# EAGLE design UnknownWatch_Top (EAGLE 9.6.2)
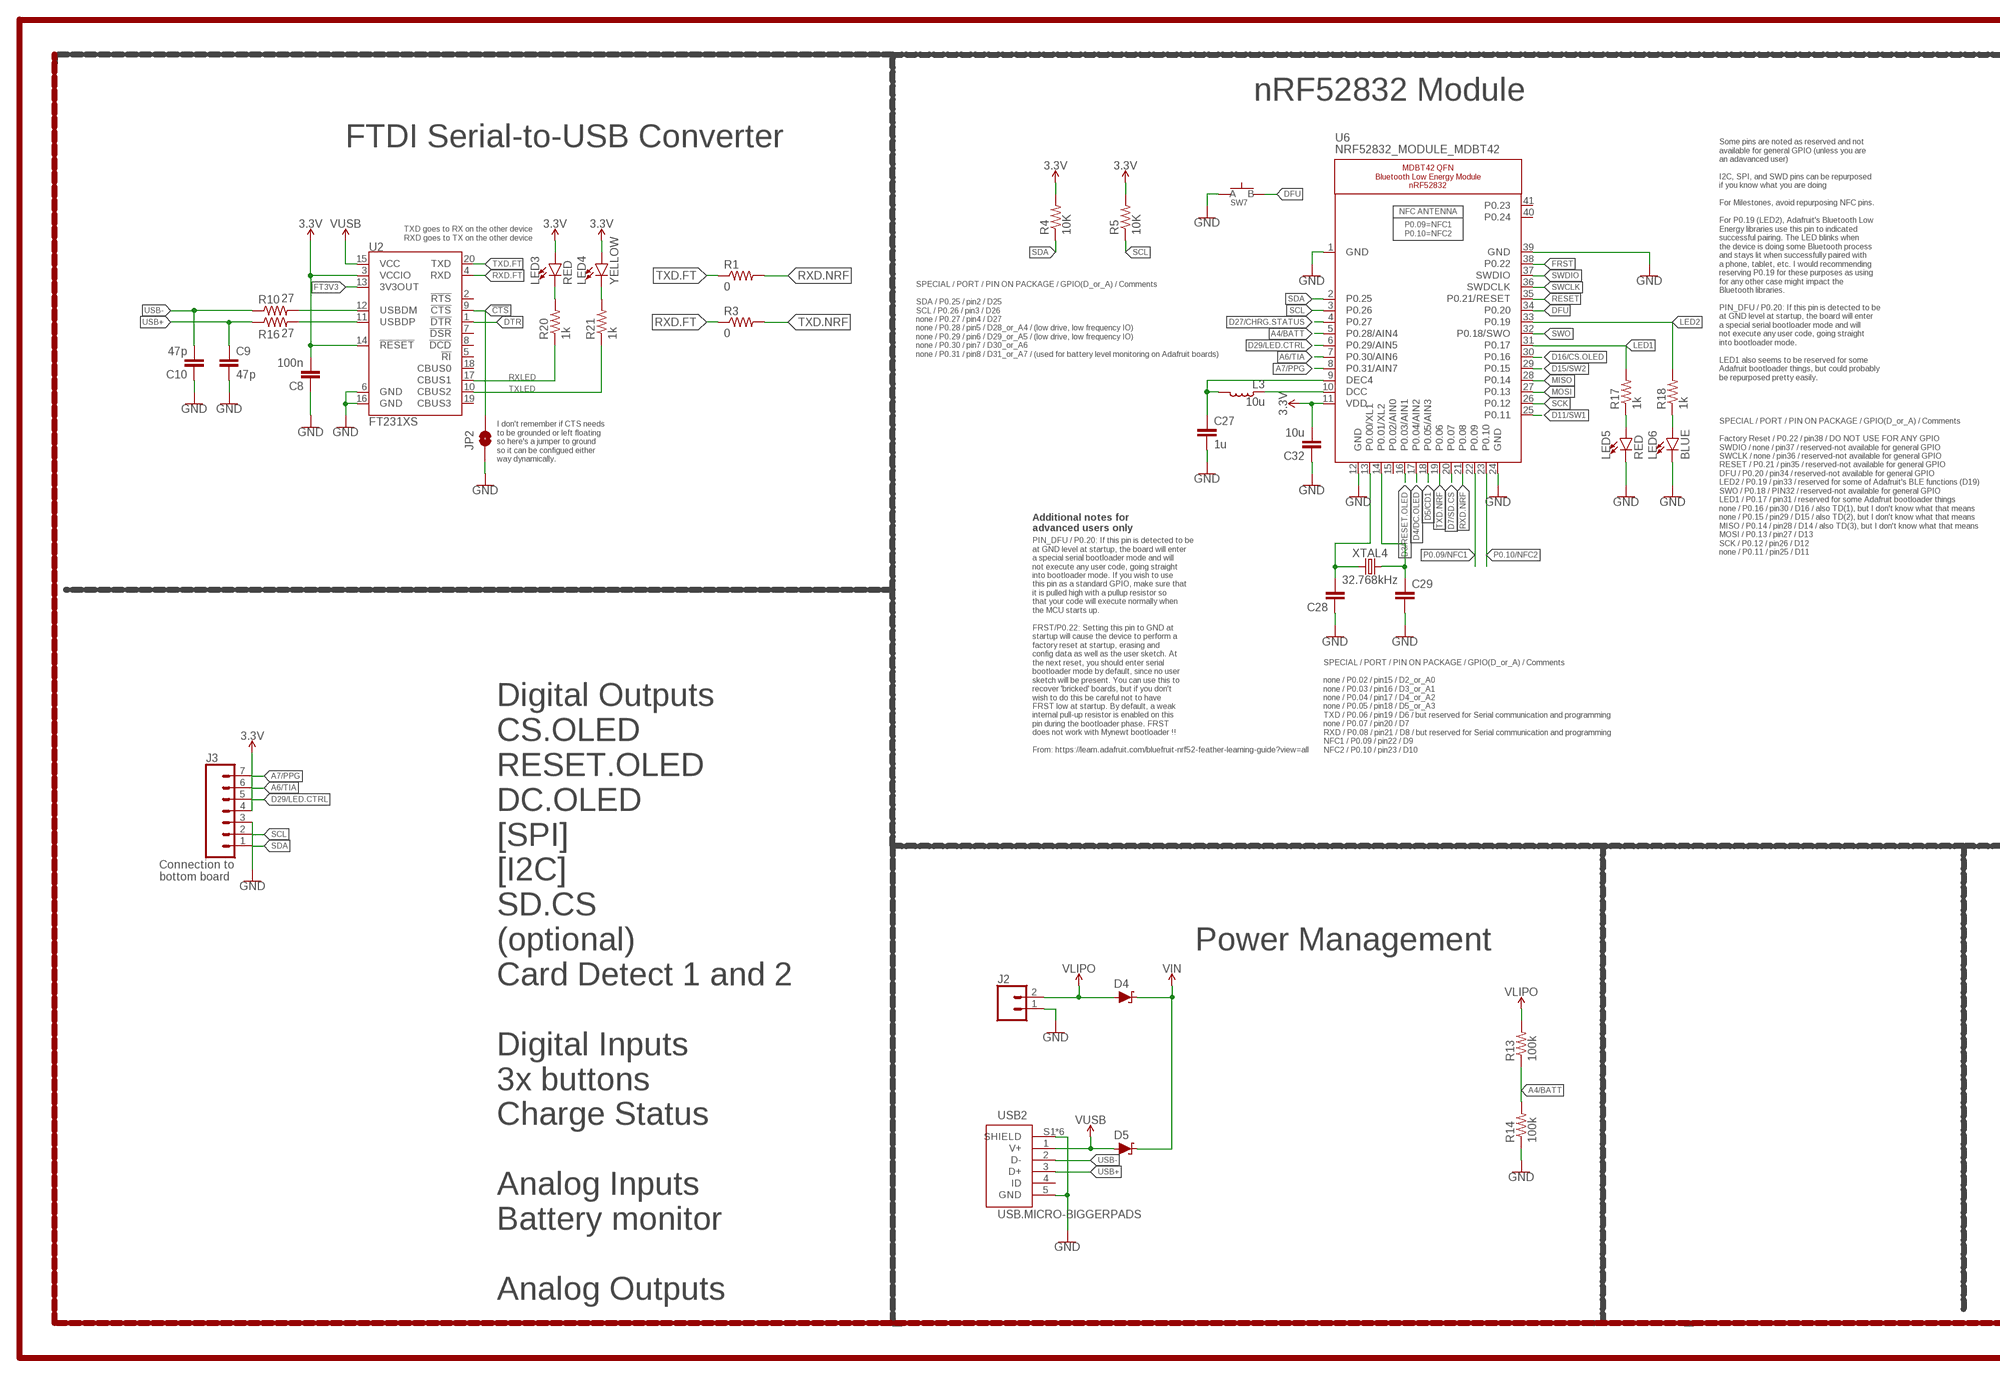
[diagram p0: schematic, sheet 1, part 1 of 2]
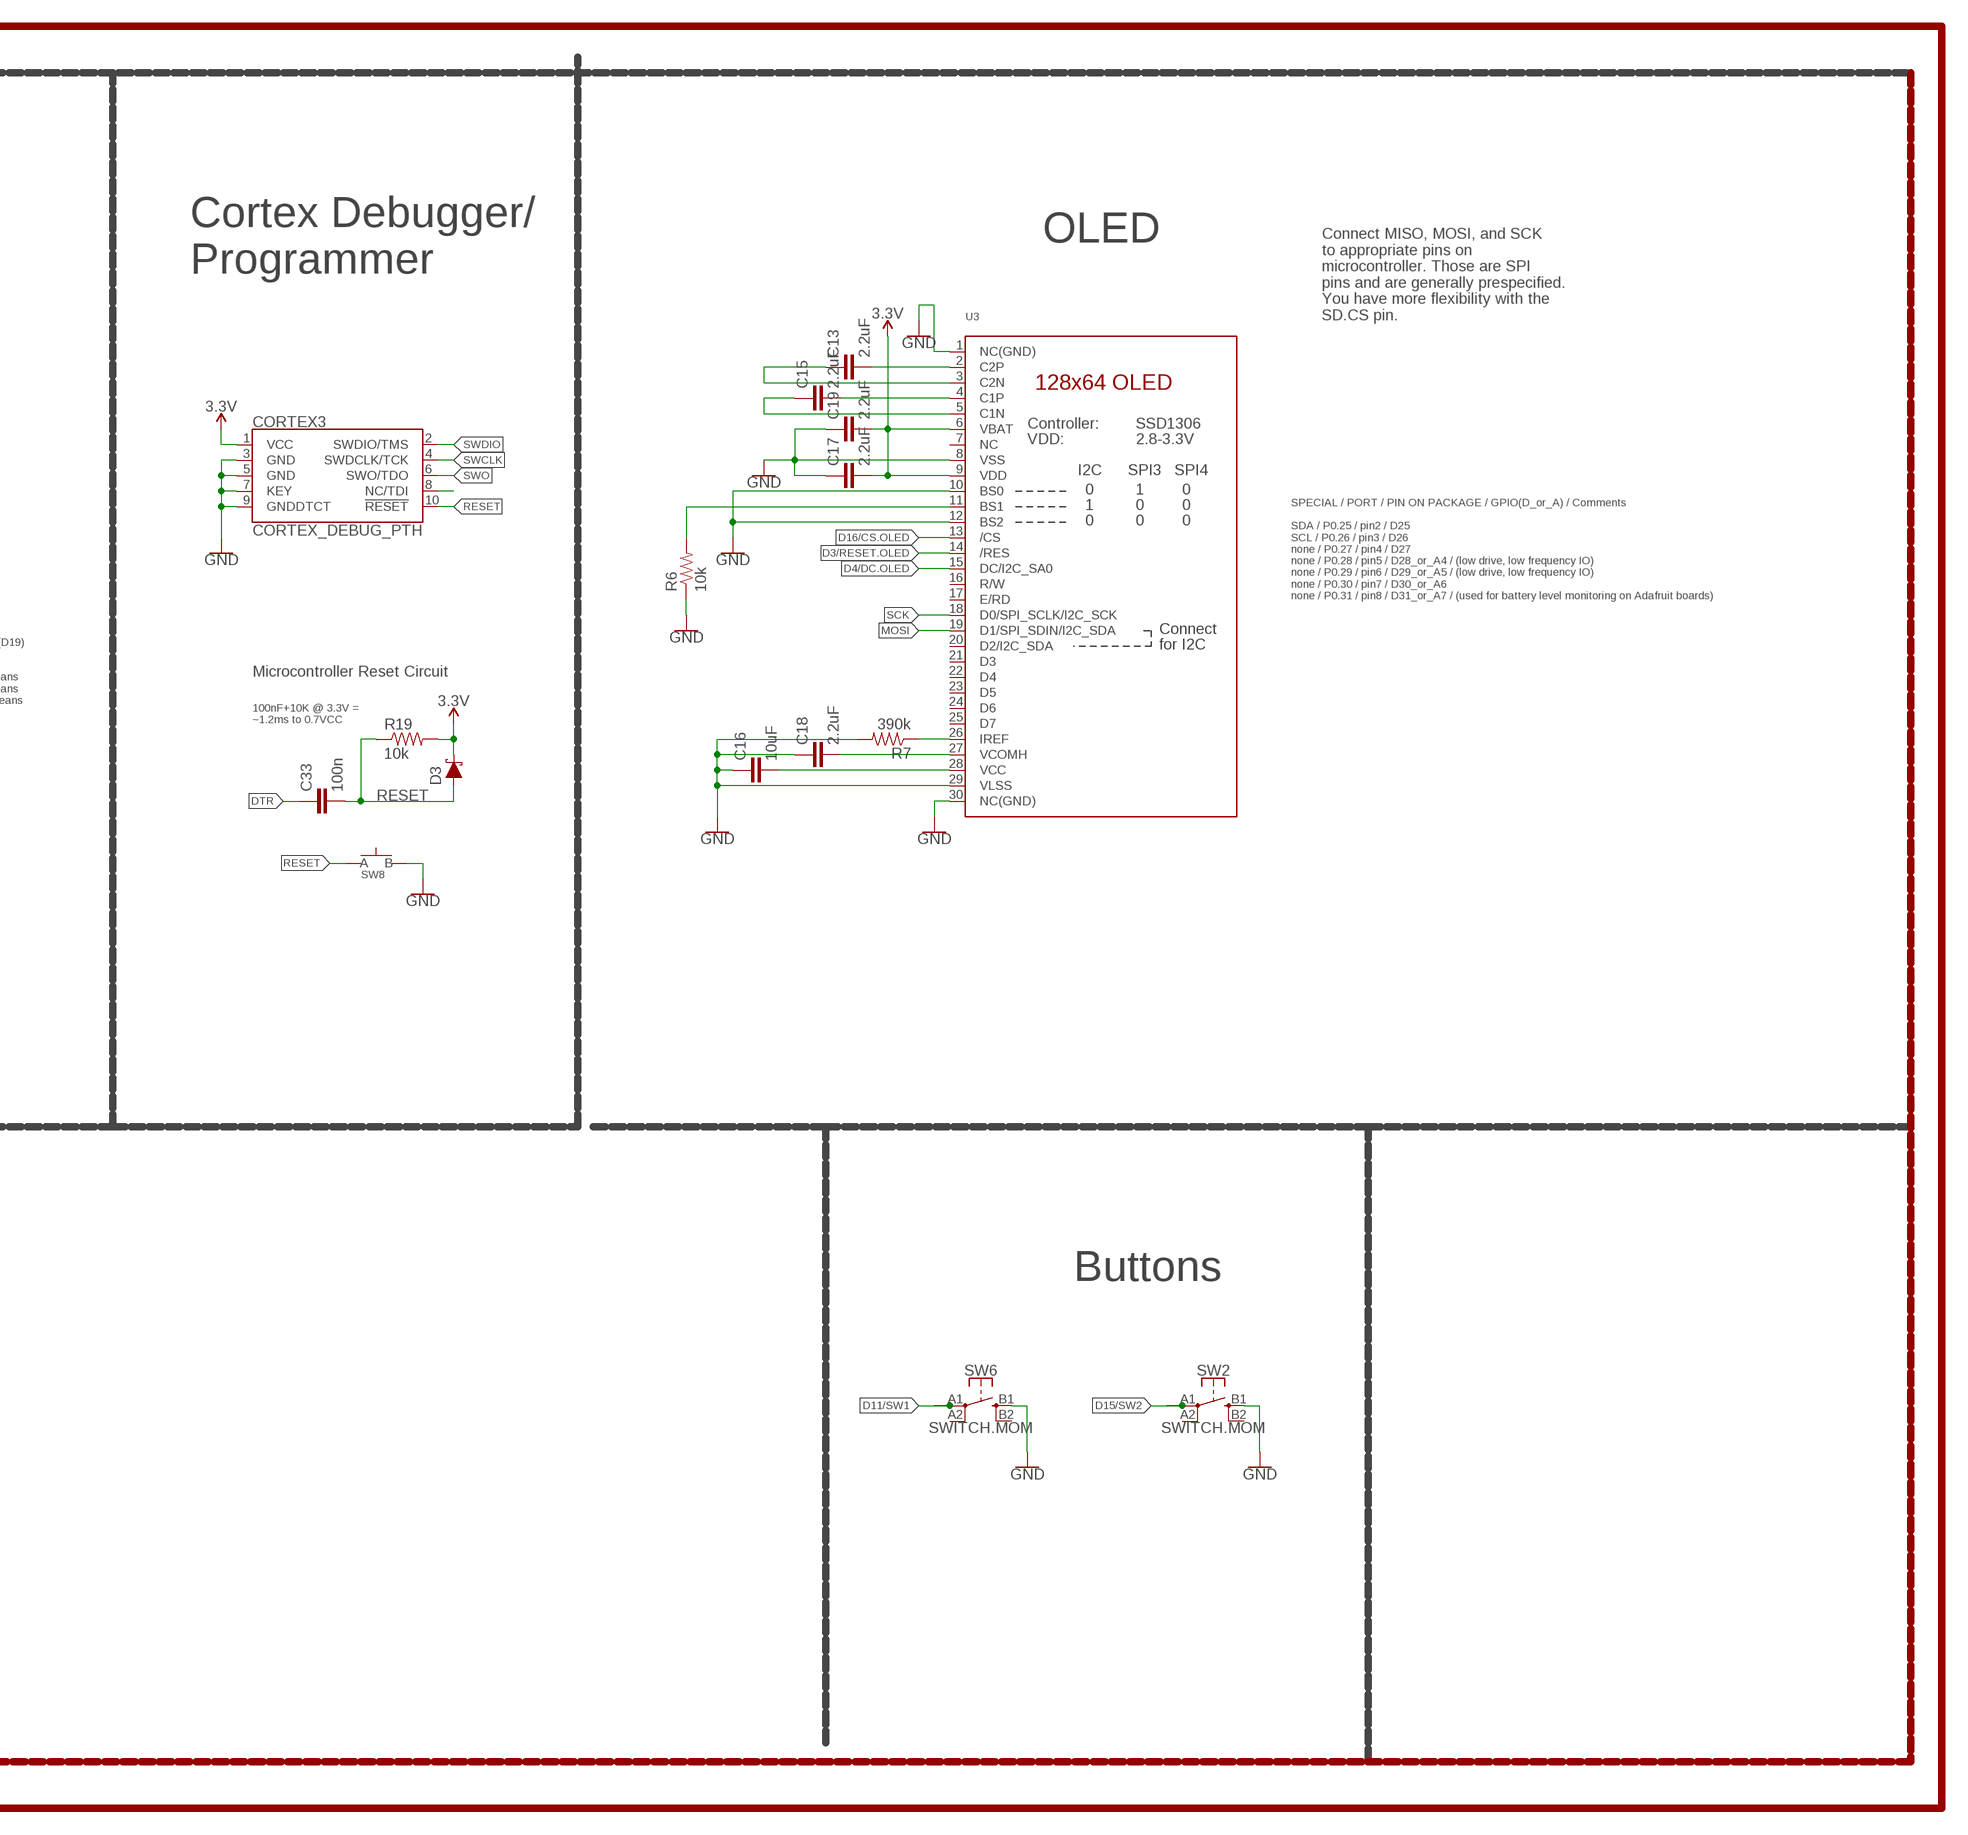
[diagram p1: schematic, sheet 1, part 2 of 2]

## Parts
C8  100n  CAPACITOR0603  [C0603]
C9  47p  CAPACITOR0603  [C0603]
C10  47p  CAPACITOR0603  [C0603]
C13  2.2uF  CAPACITOR0402  [C0402]
C15  2.2uF  CAPACITOR0402  [C0402]
C16  10uF  CAPACITOR0603  [C0603]
C17  2.2uF  CAPACITOR0402  [C0402]
C18  2.2uF  CAPACITOR0402  [C0402]
C19  2.2uF  CAPACITOR0402  [C0402]
C27  1u  CAPACITOR0603  [C0603]
C28  CAPACITOR0603  [C0603]
C29  CAPACITOR0603  [C0603]
C32  10u  CAPACITOR0805  [C0805]
C33  100n  CAPACITOR0603  [C0603]
CORTEX3  CORTEX_DEBUG_PTH  [2X5-PTH-1.27MM]
D3  SCHOTTKY-USC  [USC]
D4  SCHOTTKY-USC  [USC]
D5  SCHOTTKY-USC  [USC]
J2  CONN_02  [1X02]
J3  CONN_07-1.27MM  [1X07_1.27MM]
JP2  JUMPER-SMT_2_NO_SILK  [SMT-JUMPER_2_NO_SILK]
L3  10u  INDUCTOR0603  [L0603]
LED3  RED  LED0603  [LED-0603]
LED4  YELLOW  LED0603  [LED-0603]
LED5  RED  LED0603  [LED-0603]
LED6  BLUE  LED0603  [LED-0603]
R1  0  RESISTOR0603  [R0603]
R3  0  RESISTOR0603  [R0603]
R4  10K  RESISTOR0603  [R0603]
R5  10K  RESISTOR0603  [R0603]
R6  10k  RESISTOR0603  [R0603]
R7  390k  RESISTOR0603  [R0603]
R10  27  RESISTOR0603  [R0603]
R13  100k  RESISTOR0603  [R0603]
R14  100k  RESISTOR0603  [R0603]
R16  27  RESISTOR0603  [R0603]
R17  1k  RESISTOR0603  [R0603]
R18  1k  RESISTOR0603  [R0603]
R19  10k  RESISTOR0603  [R0603]
R20  1k  RESISTOR0603  [R0603]
R21  1k  RESISTOR0603  [R0603]
SW2  SWITCH.MOM  [TACTILE_SWITCH_SMD_6.2MM_TALL]
SW6  SWITCH.MOM  [TACTILE_SWITCH_SMD_6.2MM_TALL]
SW7  SPST-PTS830GG140-COPY.1-3  [BUTTON-GULLWING]
SW8  SPST-PTS830GG140-COPY.1-3  [BUTTON-GULLWING]
U2  FT231XS  [SSOP20_L]
U3  DISP_OLED_UG-2864HSWEG01-NO-WRAPAROUND  [UG-2864HSWEG01_0.96IN_NO-WRAPAROUND]
U6  NRF52832_MODULE_MDBT42  [BLE_MODULE_RAYTAC_MDBT42]
USB2  USB.MICRO-BIGGERPADS  [USB-MICRO-01.BIGGERPADS]
XTAL4  32.768kHz  CRYSTALECS-.327-12.5-12-C-TR  [2-SMD.NOLEAD.2.0MMTO1.2MM]

## Nets
3.3V: C8.2 C17.2 C19.2 C32.2 CORTEX3.1(VCC) D3.-(C) J3.4 LED3.A LED4.A R4.2 R5.2 R19.2 U2.3(VCCIO) U2.14(!RESET) U3.6(VBAT) U3.9(VDD) U6.11(VDD)
!CTS: JP2.2 U2.9(!CTS)
A4/BATT: R13.1 R14.2 U6.5(P0.28/AIN4)
A6/TIA: J3.6 U6.7(P0.30/AIN6)
A7/PPG: J3.7 U6.8(P0.31/AIN7)
D3/RESET.OLED: U3.14(/RES) U6.16(P0.03/AIN1)
D4/DC.OLED: U3.15(DC/I2C_SA0) U6.17(P0.04/AIN2)
D5/CD1: U6.18(P0.05/AIN3)
D7/SD.CS: U6.20(P0.07)
D11/SW1: SW6.A1 U6.25(P0.11)
D15/SW2: SW2.A1 U6.29(P0.15)
D16/CS.OLED: U3.13(/CS) U6.30(P0.16)
D27/CHRG.STATUS: U6.4(P0.27)
D29/LED.CTRL: J3.5 U6.6(P0.29/AIN5)
DFU: SW7.3(B) U6.34(P0.20)
DTR: C33.1 U2.1(!DTR)
FRST: U6.38(P0.22)
FT3V3: U2.13(3V3OUT)
GND: C8.1 C9.2 C10.1 C16.1 C17.1 C18.1 C19.1 C27.2 C28.1 C29.2 C32.1 CORTEX3.3(GND) CORTEX3.5(GND) CORTEX3.7(KEY) CORTEX3.9(GNDDTCT) J2.1 J3.3 JP2.1 LED5.C LED6.C R6.1 R7.2 R14.1 SW2.B1 SW6.B1 SW7.1(A) SW8.3(B) U2.6(GND) U2.16(GND) U3.1(NC(GND)) U3.8(VSS) U3.10(BS0) U3.12(BS2) U3.29(VLSS) U3.30(NC(GND)) U6.1(GND) U6.12(GND) U6.24(GND) U6.39(GND) USB2.5(GND) USB2.S1(SHIELD) USB2.S2(SHIELD) USB2.S3(SHIELD) USB2.S4(SHIELD) USB2.S5(SHIELD) USB2.S6(SHIELD)
LED1: R17.2 U6.31(P0.17)
LED2: R18.2 U6.33(P0.19)
MISO: U6.28(P0.14)
MOSI: U3.19(D1/SPI_SDIN/I2C_SDA) U6.27(P0.13)
N$1: R6.2 U3.11(BS1)
N$2: R7.1 U3.26(IREF)
N$3: C13.2 U3.2(C2P)
N$5: C13.1 U3.3(C2N)
N$7: C15.2 U3.4(C1P)
N$8: C15.1 U3.5(C1N)
N$11: R10.2 U2.12(USBDM)
N$12: R16.2 U2.11(USBDP)
N$13: C16.2 U3.28(VCC)
N$14: LED3.C R20.2
N$15: C18.2 U3.27(VCOMH)
N$16: LED4.C R21.2
N$26: C28.2 U6.13(P0.00/XL1) XTAL4.P$1
N$27: C29.1 U6.14(P0.01/XL2) XTAL4.P$2
N$28: LED5.A R17.1
N$29: LED6.A R18.1
N$30: L3.1 U6.10(DCC)
N$31: C27.1 L3.2 U6.9(DEC4)
N$32: CORTEX3.8(NC/TDI)
P0.09/NFC1: U6.22(P0.09)
P0.10/NFC2: U6.23(P0.10)
RESET: C33.2 CORTEX3.10(!RESET) D3.+(A) R19.1 SW8.1(A) U6.35(P0.21/RESET)
RXD.FT: R3.1 U2.4(RXD)
RXD.NRF: R1.2 U6.21(P0.08)
RXLED: R20.1 U2.17(CBUS1)
SCK: U3.18(D0/SPI_SCLK/I2C_SCK) U6.26(P0.12)
SCL: J3.2 R5.1 U6.3(P0.26)
SDA: J3.1 R4.1 U6.2(P0.25)
SWCLK: CORTEX3.4(SWDCLK/TCK) U6.36(SWDCLK)
SWDIO: CORTEX3.2(SWDIO/TMS) U6.37(SWDIO)
SWO: CORTEX3.6(SWO/TDO) U6.32(P0.18/SWO)
TXD.FT: R1.1 U2.20(TXD)
TXD.NRF: R3.2 U6.19(P0.06)
TXLED: R21.1 U2.10(CBUS2)
USB+: C9.1 R16.1 USB2.3(D+)
USB-: C10.2 R10.1 USB2.2(D-)
V_USB: D5.+(A) U2.15(VCC) USB2.1(V+) ; supply symbol labelled VUSB
VIN: D4.-(C) D5.-(C)
VLIPO: D4.+(A) J2.2 R13.2
Unconnected: SW2.A2 SW2.B2 SW6.A2 SW6.B2 U2.2(!RTS) U2.5(!RI) U2.7(!DSR) U2.8(!DCD) U2.18(CBUS0) U2.19(CBUS3) U3.7(NC) U3.16(R/W) U3.17(E/RD) U3.20(D2/I2C_SDA) U3.21(D3) U3.22(D4) U3.23(D5) U3.24(D6) U3.25(D7) U6.15(P0.02/AIN0) U6.40(P0.24) U6.41(P0.23) USB2.4(ID)

## Notes on the sheet
- nRF52832 Module
- FTDI Serial-to-USB Converter
- OLED
- Cortex Debugger/
  Programmer
- TXD goes to RX on the other device
  RXD goes to TX on the other device
- Connect MISO, MOSI, and SCK
  to appropriate pins on
  microcontroller. Those are SPI
  pins and are generally prespecified.
  You have more flexibility with the
  SD.CS pin.
- SPECIAL / PORT / PIN ON PACKAGE / GPIO(D_or_A) / Comments
  
  SDA / P0.25 / pin2 / D25
  SCL / P0.26 / pin3 / D26
  none / P0.27 / pin4 / D27
  none / P0.28 / pin5 / D28_or_A4 / (low drive, low frequency IO)
  none / P0.29 / pin6 / D29_or_A5 / (low drive, low frequency IO)
  none / P0.30 / pin7 / D30_or_A6
  none / P0.31 / pin8 / D31_or_A7 / (used for battery level monitoring on Adafruit boards)
- Some pins are noted as reserved and not
  available for general GPIO (unless you are
  an adavanced user)
  
  I2C, SPI, and SWD pins can be repurposed
  if you know what you are doing
  
  For Milestones, avoid repurposing NFC pins.
  
  For P0.19 (LED2), Adafruit's Bluetooth Low
  Energy libraries use this pin to indicated
  successful pairing. The LED blinks when
  the device is doing some Bluetooth process
  and stays lit when successfully paired with
  a phone, tablet, etc. I would recommending
  reserving P0.19 for these purposes as using
  for any other case might impact the
  Bluetooth libraries.
  
  PIN_DFU / P0.20: If this pin is detected to be
  at GND level at startup, the board will enter
  a special serial bootloader mode and will
  not execute any user code, going straight
  into bootloader mode.
  
  LED1 also seems to be reserved for some
  Adafruit bootloader things, but could probably
  be repurposed pretty easily.
- SPECIAL / PORT / PIN ON PACKAGE / GPIO(D_or_A) / Comments
  
  SDA / P0.25 / pin2 / D25
  SCL / P0.26 / pin3 / D26
  none / P0.27 / pin4 / D27
  none / P0.28 / pin5 / D28_or_A4 / (low drive, low frequency IO)
  none / P0.29 / pin6 / D29_or_A5 / (low drive, low frequency IO)
  none / P0.30 / pin7 / D30_or_A6
  none / P0.31 / pin8 / D31_or_A7 / (used for battery level monitoring on Adafruit boards)
- I don't remember if CTS needs
  to be grounded or left floating
  so here's a jumper to ground
  so it can be configued either
  way dynamically.
- Microcontroller Reset Circuit
- Additional notes for
  advanced users only
- 100nF+10K @ 3.3V =
  ~1.2ms to 0.7VCC
- SPECIAL / PORT / PIN ON PACKAGE / GPIO(D_or_A) / Comments
  
  Factory Reset / P0.22 / pin38 / DO NOT USE FOR ANY GPIO
  SWDIO / none / pin37 / reserved-not available for general GPIO
  SWCLK / none / pin36 / reserved-not available for general GPIO
  RESET / P0.21 / pin35 / reserved-not available for general GPIO
  DFU / P0.20 / pin34 / reserved-not available for general GPIO
  LED2 / P0.19 / pin33 / reserved for some of Adafruit's BLE functions (D19)
  SWO / P0.18 / PIN32 / reserved-not available for general GPIO
  LED1 / P0.17 / pin31 / reserved for some Adafruit bootloader things
  none / P0.16 / pin30 / D16 / also TD(1), but I don't know what that means
  none / P0.15 / pin29 / D15 / also TD(2), but I don't know what that means
  MISO / P0.14 / pin28 / D14 / also TD(3), but I don't know what that means
  MOSI / P0.13 / pin27 / D13
  SCK / P0.12 / pin26 / D12
  none / P0.11 / pin25 / D11
- PIN_DFU / P0.20: If this pin is detected to be
  at GND level at startup, the board will enter
  a special serial bootloader mode and will
  not execute any user code, going straight
  into bootloader mode. If you wish to use
  this pin as a standard GPIO, make sure that
  it is pulled high with a pullup resistor so
  that your code will execute normally when
  the MCU starts up.
  
  FRST/P0.22: Setting this pin to GND at
  startup will cause the device to perform a
  factory reset at startup, erasing and
  config data as well as the user sketch. At
  the next reset, you should enter serial
  bootloader mode by default, since no user
  sketch will be present. You can use this to
  recover 'bricked' boards, but if you don't
  wish to do this be careful not to have
  FRST low at startup. By default, a weak
  internal pull-up resistor is enabled on this
  pin during the bootloader phase. FRST
  does not work with Mynewt bootloader !!
  
  From: https://learn.adafruit.com/bluefruit-nrf52-feather-learning-guide?view=all
- SPECIAL / PORT / PIN ON PACKAGE / GPIO(D_or_A) / Comments
  
  none / P0.02 / pin15 / D2_or_A0
  none / P0.03 / pin16 / D3_or_A1
  none / P0.04 / pin17 / D4_or_A2
  none / P0.05 / pin18 / D5_or_A3
  TXD / P0.06 / pin19 / D6 / but reserved for Serial communication and programming
  none / P0.07 / pin20 / D7
  RXD / P0.08 / pin21 / D8 / but reserved for Serial communication and programming
  NFC1 / P0.09 / pin22 / D9
  NFC2 / P0.10 / pin23 / D10
- Connection to 
  bottom board
- Power Management
- Buttons
- Digital Outputs
  CS.OLED
  RESET.OLED
  DC.OLED
  [SPI]
  [I2C]
  SD.CS
  (optional) 
  Card Detect 1 and 2
  
  Digital Inputs 
  3x buttons
  Charge Status
  
  Analog Inputs 
  Battery monitor
  
  Analog Outputs

## Library data of the parts
C8-C10 C13 C15-C19 C27-C29 C32 C33 = LinnesLab-Passives:CAPACITOR
CORTEX3 = LinnesLab-Connectors:CORTEX_DEBUG: Cortex Debug Connector - 10 pin Supports JTAG debug, Serial Wire debug, and Serial Wire Viewer. PTH and SMD connector options available. General Connector Information <http://infocenter.arm.com/help/topic/com.arm.doc.faqs/attached/13634/cortex_debug_connectors.pdf> Products: PTH Connector <http://www.digikey.com/product-detail/en/cnc-tech/3220-10-0100-00/1175-1627-ND/3883661> -via Digi-Key SparkFun PSoc <https://www.sparkfun.com/products/13229> SparkFun T <https://www.sparkfun.com/products/13810>
D3-D5 = LinnesLab-DiscreteSemi:SCHOTTKY: Schottky diode A Schottky diode is a semiconductor diode which has a low forward voltage drop and a very fast switching action. Example: Digi-Key Part Number: RB161MM-20CT-ND
J2 = LinnesLab-Connectors:CONN_02: Multi connection point. Often used as Generic Header-pin footprint for 0.1 inch spaced/style header connections On any of the 0.1 inch spaced packages, you can populate with these: Break Away Headers - Straight <https://www.sparkfun.com/products/116> (PRT-00116) Break Away Male Headers - Right Angle <https://www.sparkfun.com/products/553> (PRT-00553) Female Headers <https://www.sparkfun.com/products/115> (PRT-00115) Break Away Headers - Machine Pin <https://www.sparkfun.com/products/117> (PRT-00117) Break Away Female Headers - Swiss Machine Pin <https://www.sparkfun.com/products/743> (PRT-00743) For SCREWTERMINALS and SPRING TERMINALS visit here: Screw Terimnals on SparkFun.com <https://www.sparkfun.com/search/results?term=Screw+Terminals> (5mm/3.5mm/2.54mm spacing) This device is also useful as a general connection point to wire up your design to another part of your project. Our various solder wires solder well into these plated through hole pads. Hook-Up Wire - Assortment (Stranded, 22 AWG) <https://www.sparkfun.com/products/11375> (PRT-11375) Hook-Up Wire - Assortment (Solid Core, 22 AWG) <https://www.sparkfun.com/products/11367> (PRT-11367) View the entire wire category on our website here <https://www.sparkfun.com/categories/141> Special notes: Molex polarized connector foot print use with: PRT-08233 with associated crimp pins and housings. 2.54_SCREWTERM for use with PRT-10571. 3.5mm Screw Terminal footprints for PRT-08084 5mm Screw Terminal footprints for use with PRT-08432
J3 = LinnesLab-Connectors:CONN_07: Multi connection point. Often used as Generic Header-pin footprint for 0.1 inch spaced/style header connections On any of the 0.1 inch spaced packages, you can populate with these: Break Away Headers - Straight <https://www.sparkfun.com/products/116> (PRT-00116) Break Away Male Headers - Right Angle <https://www.sparkfun.com/products/553> (PRT-00553) Female Headers <https://www.sparkfun.com/products/115> (PRT-00115) Break Away Headers - Machine Pin <https://www.sparkfun.com/products/117> (PRT-00117) Break Away Female Headers - Swiss Machine Pin <https://www.sparkfun.com/products/743> (PRT-00743) For SCREWTERMINALS and SPRING TERMINALS visit here: Screw Terimnals on SparkFun.com <https://www.sparkfun.com/search/results?term=Screw+Terminals> (5mm/3.5mm/2.54mm spacing) This device is also useful as a general connection point to wire up your design to another part of your project. Our various solder wires solder well into these plated through hole pads. Hook-Up Wire - Assortment (Stranded, 22 AWG) <https://www.sparkfun.com/products/11375> (PRT-11375) Hook-Up Wire - Assortment (Solid Core, 22 AWG) <https://www.sparkfun.com/products/11367> (PRT-11367) View the entire wire category on our website here <https://www.sparkfun.com/categories/141> Special notes: Molex polarized connector foot print use with SKU : PRT-08231 with associated crimp pins and housings. 1MM SMD Version SKU: PRT-10208 NOTES ON THE VARIANTS LOCK and LOCK_LONGPADS... This footprint was designed to help hold the alignment of a through-hole component (i.e. 6-pin header) while soldering it into place. You may notice that each hole has been shifted either up or down by 0.005 of an inch from it's more standard position (which is a perfectly straight line). This slight alteration caused the pins (the squares in the middle) to touch the edges of the holes. Because they are alternating, it causes a "brace" to hold the component in place. 0.005 has proven to be the perfect amount of "off-center" position when using our standard breakaway headers. Although looks a little odd when you look at the bare footprint, once you have a header in there, the alteration is very hard to notice. Also,if you push a header all the way into place, it is covered up entirely on the bottom side.
JP2 = LinnesLab-Switches:JUMPER-SMT_2_NO: Normally open jumper This jumper has two pads in close proximity to each other. Apply solder to close the connection. Round pads are easier to solder for beginners, but are a lot larger. SparkFun Product that uses the round pads: SparkFun EL Sequencer <https://www.sparkfun.com/products/12781>
L3 = LinnesLab-Passives:INDUCTOR
LED3-LED6 = LinnesLab-LED:LED: LED (Generic) Standard schematic elements and footprints for 5mm, 3mm, 1206, and 0603 sized LEDs. Generic LEDs with no color specified. LTST-C190KGKT: arrow indicates cathode
R1 R3-R7 R10 R13 R14 R16-R21 = LinnesLab-Passives:RESISTOR
SW2 SW6 = LinnesLab-Switches:SWITCH.MOM: PTS645SM43SMTR92 LFS
SW7 SW8 = LinnesLab-Switches:SPST-PTS830GG140-COPY
U2 = LinnesLab-DigitalIC:FT231X: FTDI FT231X Full Speed USB to Full-handshake UART This USB2.0 Full Speed IC offers a compact bridge to full handshake UART interfaces. The device is a UART, capable of operating up to 3MBaud, with low power consumption (8mA). The FT231X includes the complete FT-X series feature set and enables USB to be added into a system design quickly and easily over a UART interface. Datasheet <http://cdn.sparkfun.com/datasheets/Components/General%20IC/DS_FT231X.pdf>; DIGIKEY: 768-1156-5-ND; MFN: FT231XS-U
U3 = LinnesLab-Displays:DISP_OLED_UG-2864HSWEG01: UG-2864HSWEG01 OLED display Both 1.3" and 0.96" models share the same FPC tab footprint, only the screen dimensions vary.
U6 = LinnesLab-Microcontrollers:NRF52832_MODULE_MDBT42: MDBT42 - BLE Module (nRF52832 QFN) VDD: 1.7-3.6V
USB2 = LinnesLab-Connectors:USB.MICRO: DigiKey PN: 609-4613-1-ND
XTAL4 = LinnesLab-Clocks:CRYSTAL; DIGIKEY: XC2288CT-ND; FREQ: 32.7680KHZ; LOAD_CAP: 12.5pF

## Board
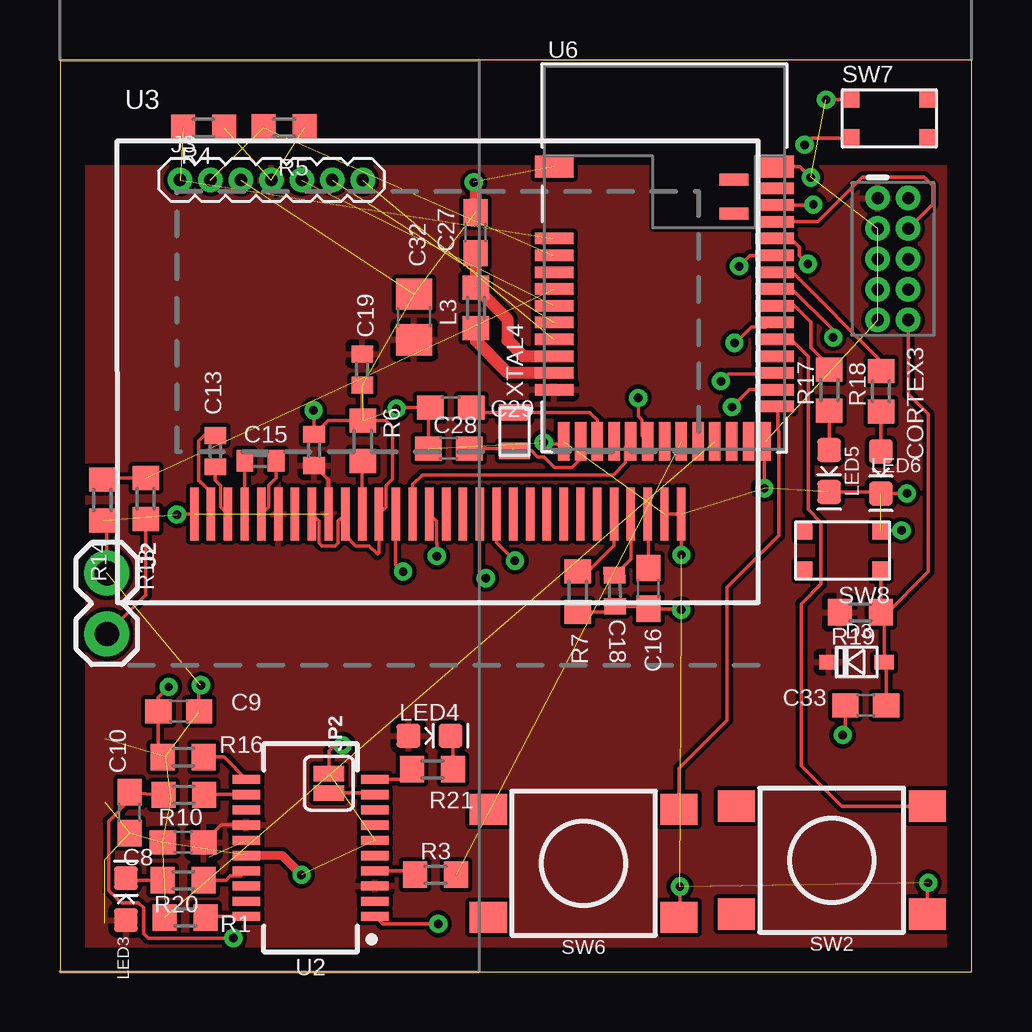
[diagram p2: board, top side]
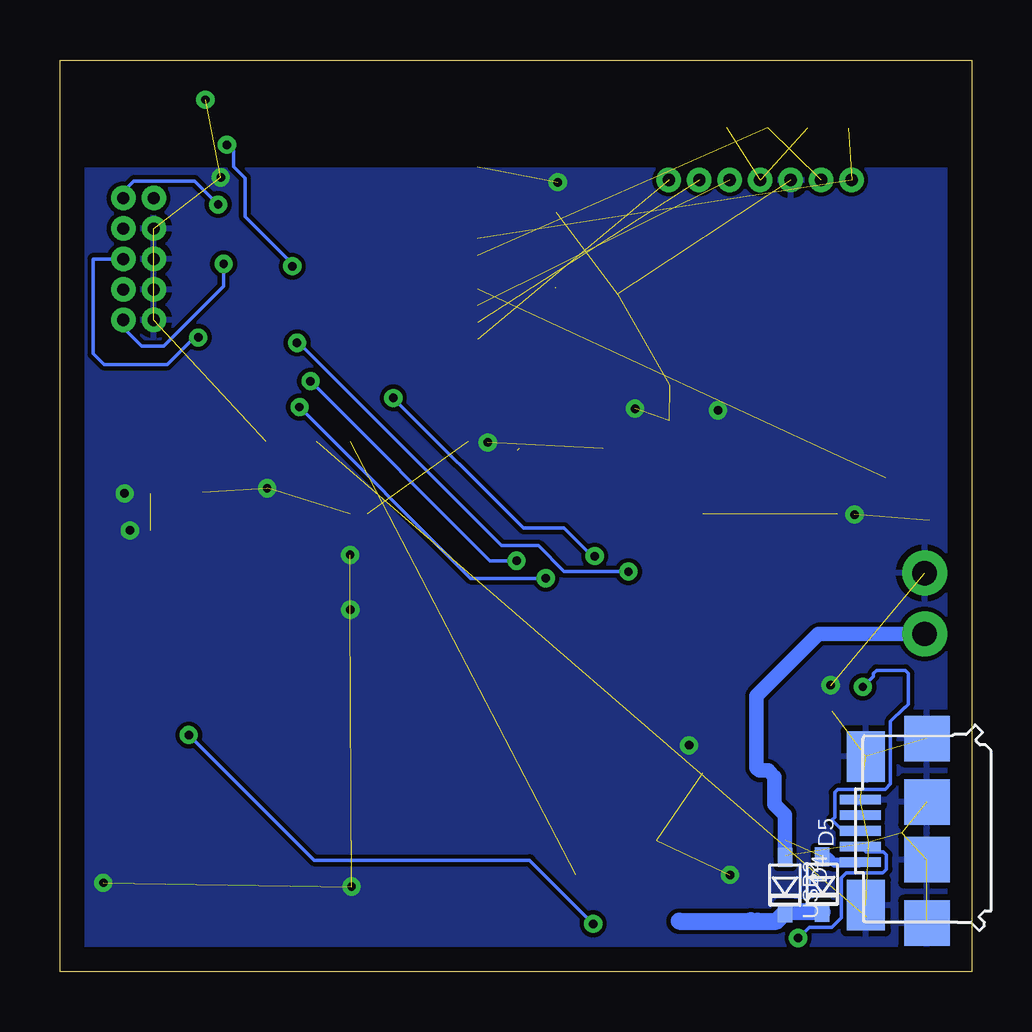
[diagram p3: board, bottom side, seen from below]

Size 38 x 38 mm. Coordinates in mm from the lower left corner, seen from the top.
Outline: 0,0 38,0 38,38 0,38 0,0
Copper layers (1*16): Top 0.035mm / dielectric 1.5mm / Bottom 0.035mm
Design rules "default": minimum track width 6mil, minimum drill 0.35mm, track to track 6mil, track to pad 6mil, pad to pad 6mil, via to via 6mil, smd to smd 6mil, copper to edge 40mil, drill to drill 6mil, minimum pad ring 10mil, minimum via ring 8mil, stop-mask expansion 4mil, vias tented up to drill 0mil, thermal gap 10mil

### Footprints (pad centres in the part's own frame; a part is rotated, then mirrored left to right if it is on the bottom)
C0603 = smd 1.1 x 1: 1 -0.85,0; 2 0.85,0
C0402 = smd 0.7 x 0.9: 1 -0.65,0; 2 0.65,0
C0805 = smd 1.3 x 1.5: 1 -0.95,0; 2 0.95,0
2X5-PTH-1.27MM = drill 0.508 pad 1: 1 -2.54,-0.635; 2 -2.54,0.635; 3 -1.27,-0.635; 4 -1.27,0.635; 5 0,-0.635; 6 0,0.635; 7 1.27,-0.635; 8 1.27,0.635; 9 2.54,-0.635; 10 2.54,0.635
USC = smd 0.8 x 0.6: + -1.15,0; - 1.15,0
1X02 = drill 1.016 pad 1.88: 1 0,0; 2 2.54,0
1X07_1.27MM = drill 0.508 pad 1: 1 0,0; 2 1.27,0; 3 2.54,0; 4 3.81,0; 5 5.08,0; 6 6.35,0; 7 7.62,0
SMT-JUMPER_2_NO_SILK = smd 0.635 x 1.27: 1 -0.406,0; 2 0.406,0
L0603 = smd 1 x 1.1: 1 -0.85,0; 2 0.85,0
LED-0603 = smd 1 x 1: A -0.877,0; C 0.877,0
R0603 = smd 1 x 1.1: 1 -0.85,0; 2 0.85,0
TACTILE_SWITCH_SMD_6.2MM_TALL = smd 1.55 x 1.3: A1 -3.975,-2.25; A2 3.975,-2.25; B1 -3.975,2.25; B2 3.975,2.25
BUTTON-GULLWING = smd 0.7 x 0.75: 1 -1.6,0.825; 2 1.6,0.825; 3 -1.6,-0.825; 4 1.6,-0.825
SSOP20_L = smd 0.381 x 1.143: 1 -2.857,-2.68; 2 -2.223,-2.68; 3 -1.587,-2.68; 4 -0.953,-2.68; 5 -0.318,-2.68; 6 0.318,-2.68; 7 0.953,-2.68; 8 1.587,-2.68; 9 2.223,-2.68; 10 2.857,-2.68; 11 2.857,2.68; 12 2.223,2.68; 13 1.587,2.68; 14 0.953,2.68; 15 0.318,2.68; 16 -0.318,2.68; 17 -0.953,2.68; 18 -1.587,2.68; 19 -2.223,2.68; 20 -2.857,2.68
UG-2864HSWEG01_0.96IN_NO-WRAPAROUND = smd 0.35 x 2.2: 1 -10.15,-1.2; 2 -9.45,-1.2; 3 -8.75,-1.2; 4 -8.05,-1.2; 5 -7.35,-1.2; 6 -6.65,-1.2; 7 -5.95,-1.2; 8 -5.25,-1.2; 9 -4.55,-1.2; 10 -3.85,-1.2; 11 -3.15,-1.2; 12 -2.45,-1.2; 13 -1.75,-1.2; 14 -1.05,-1.2; 15 -0.35,-1.2; 16 0.35,-1.2; 17 1.05,-1.2; 18 1.75,-1.2; 19 2.45,-1.2; 20 3.15,-1.2; 21 3.85,-1.2; 22 4.55,-1.2; 23 5.25,-1.2; 24 5.95,-1.2; 25 6.65,-1.2; 26 7.35,-1.2; 27 8.05,-1.2; 28 8.75,-1.2; 29 9.45,-1.2; 30 10.15,-1.2
BLE_MODULE_RAYTAC_MDBT42 = smd 1.6 x 0.9: 1 -4.6,3.8; 39 4.6,3.8 | smd 1.6 x 0.48: 2 -4.6,0.8; 3 -4.6,0.1; 4 -4.6,-0.6; 5 -4.6,-1.3; 6 -4.6,-2; 7 -4.6,-2.7; 8 -4.6,-3.4; 9 -4.6,-4.1; 10 -4.6,-4.8; 11 -4.6,-5.5; 25 4.6,-6.2; 26 4.6,-5.5; 27 4.6,-4.8; 28 4.6,-4.1; 29 4.6,-3.4; 30 4.6,-2.7; 31 4.6,-2; 32 4.6,-1.3; 33 4.6,-0.6; 34 4.6,0.1; 35 4.6,0.8; 36 4.6,1.5; 37 4.6,2.2; 38 4.6,2.9 | smd 0.48 x 1.6: 12 -4.2,-7.65; 13 -3.5,-7.65; 14 -2.8,-7.65; 15 -2.1,-7.65; 16 -1.4,-7.65; 17 -0.7,-7.65; 18 0,-7.65; 19 0.7,-7.65; 20 1.4,-7.65; 21 2.1,-7.65; 22 2.8,-7.65; 23 3.5,-7.65; 24 4.2,-7.65 | smd 1.2 x 0.5: 40 2.9,3.25; 41 2.9,1.85
USB-MICRO-01.BIGGERPADS = smd 0.4 x 1.7: 1 -1.3,1.505; 2 -0.65,1.505; 3 0,1.505; 4 0.65,1.505; 5 1.3,1.505 | smd 1.9 x 1.9: S1 -3.85,-1.27; S2 -1.2,-1.27; S3 1.2,-1.27; S4 3.85,-1.27 | smd 2.1 x 1.6: S5 -3.1,1.28; S6 3.1,1.28
2-SMD.NOLEAD.2.0MMTO1.2MM = smd 0.7 x 1.3: P$1 -0.8,0; P$2 0.8,0

### Placement (x,y rotation side)
C8  5.14,5.38 0 top
C9  4.95,10.85 0 top
C10  2.91,6.63 90 top
C13  6.48,21.69 90 top
C15  8.36,21.29 180 top
C16  24.53,15.97 90 top
C17  10.59,21.74 270 top
C18  23.13,15.87 91 top
C19  12.6,25.1 90 top
C27  17.33,30.8 90 top
C28  16.21,21.81 0 top
C29  16.29,23.5 180 top
C32  14.76,27.29 270 top
C33  33.59,11.1 0 top
CORTEX3  34.72,29.7 270 top
D3  33.21,12.9 180 top
D4  7.77,3.61 270 bottom
D5  6.22,3.63 270 bottom
J2  1.96,16.61 270 top
J3  5,33 0 top
JP2  11.21,7.85 270 top
L3  17.34,27.66 90 top
LED3  2.75,3.02 90 top
LED4  15.4,9.83 0 top
LED5  32.06,20.86 270 top
LED6  34.22,20.81 270 top
R1  5.22,2.26 180 top
R3  15.66,4.04 0 top
R4  5.98,35.17 0 top
R5  9.34,35.18 0 top
R6  12.62,22.12 270 top
R7  21.58,15.83 270 top
R10  5.17,7.36 0 top
R13  3.58,19.71 270 top
R14  1.77,19.65 90 top
R16  5.14,8.94 0 top
R17  32.06,24.24 90 top
R18  34.22,24.19 90 top
R19  33.36,14.97 180 top
R20  5.14,3.81 180 top
R21  15.53,8.43 0 top
SW2  32.18,4.64 180 top
SW6  21.83,4.51 180 top
SW7  34.57,35.56 0 top
SW8  32.62,17.55 180 top
U2  10.45,5.15 90 top
U3  15.75,20.27 0 top
U6  25.2,29.75 0 top
USB2  3.12,5.86 90 bottom
XTAL4  18.95,22.51 90 top

### Tracks (layer width: path | path; a pad name or v marks a point on that pad's centre or on a via)
3.3V  (3 unrouted)
  Top 0.152: C8.2 6.01,5.4 | 6.01,5.4 6.71,6.11 U2.14 | 6.29,5.4 6.01,5.4 | C17.2 11.2,20.49 U3.9
  pour Top (isolate 0.178): 37.69,33.55 0.51,33.55 0.51,0.17 37.69,0.17
!CTS
  Top 0.152: JP2.2 13.07,7.44 U2.9
A4/BATT  (1 unrouted)
  Top 0.152: R14.2 1.83,20.56 R13.1
A6/TIA  (1 unrouted)
A7/PPG  (1 unrouted)
D3/RESET.OLED
  Top 0.152: U6.16 23.57,21.87 23.57,21.21 23.06,20.7 15.11,20.7 14.7,20.3 U3.14
D4/DC.OLED  (via drill 0.35)
  Top 0.152: U6.17 24.27,22.34 24.27,23 24.11,23.16 v24.11,23.91 | v15.71,17.32 15.71,17.86 15.69,17.88 15.69,18.77 U3.15
  Bottom 0.152: v24.11,23.91 18.68,18.48 16.98,18.48 15.76,17.26 v15.71,17.32 | v15.71,17.32
D11/SW1
  Top 0.152: U6.25 29.93,23.43 29.93,22.56 29.97,22.52 29.97,18.18 27.81,16.01 27.81,10.47 25.8,8.47 SW6.A1
D15/SW2
  Top 0.152: U6.29 29.85,26.3 30.52,26.3 31.19,25.64 31.19,19.26 31.73,18.73 31.73,16.15 30.9,15.33 30.9,8.58 32.59,6.89 SW2.A1
D16/CS.OLED  (via drill 0.35)
  Top 0.152: U6.30 29.6,27.05 29.42,26.87 28.83,26.87 28.09,26.14 28.09,26.19 v28.12,26.21 | v14.3,16.67 14,16.98 U3.13
  Bottom 0.152: v28.12,26.21 28.04,26.21 19.59,17.75 18.06,17.75 16.98,16.67 v14.3,16.67
D29/LED.CTRL  (1 unrouted)
DFU  (via drill 0.35)
  Top 0.152: U6.34 28.76,29.85 v28.31,29.4 | v31.04,34.47 31.32,34.74 SW7.3
  Bottom 0.152: v28.31,29.4 28.31,29.5 30.29,31.48 30.29,33.07 30.77,33.55 30.77,34.19 v31.04,34.47
DTR  (via drill 0.35)
  Top 0.152: C33.1 32.74,9.97 v32.63,9.86 | v15.77,1.99 13.44,1.99 U2.1
  Bottom 0.152: v32.63,9.86 27.41,4.64 18.42,4.64 v15.77,1.99
GND  (via drill 0.35)  (35 unrouted)
  Top 0.152: JP2.1 11.21,9.19 11.45,9.43 v11.78,9.43 | U3.1 4.88,19.07 v4.88,19.05 | C19.1 12.6,22.97 11.17,22.97 C17.1 10.59,23.37 v10.57,23.39 | R6.1 13.6,22.97 13.87,22.71 13.87,20.54 13.59,20.26 13.59,19.37 U3.12 13.3,17.46 13.23,17.4 12.89,17.74 12.33,17.74 11.9,18.17 U3.10 11.6,18.77 11.6,17.88 11.47,17.74 10.93,17.74 10.79,17.88 10.79,18.77 U3.8 | v5.87,11.94 5.79,11.85 5.79,10.87 C9.2 | R14.1 1.96,18.62 J2.1 | U3.29 U3.30 25.9,17.38 v25.91,17.37 | 21.61,15.01 R7.2 22.9,14.98 C18.1 24.44,15.22 C16.1 25.86,15.12 v25.9,15.08 | SW2.B1 36.15,3.66 v36.19,3.7 | SW6.B1 25.84,2.3 v25.84,3.54 | C28.1 15.36,23.42 C29.2 14.07,23.5 v14.03,23.46 | LED6.C 34.25,19.93 | 34.25,19.93 35.06,19.93 35.07,19.92 35.11,19.92 35.12,19.93 v35.31,19.93 | U6.24 29.36,22.07 v29.36,20.15 | LED5.C 34.19,19.99 34.25,19.93 | SW8.3 34.24,18.39 v35.08,18.39 | SW7.1 32.93,36.34 v31.93,36.34 | U6.39 30.85,33.55 v31.3,33.11 | U6.12 20.89,22 20.23,22 v20.17,22.05
  Top 0.356: U2.16 9.26,4.84 v10.07,4.03
  Top 0.508: v17.25,32.9 17.33,32.82 C27.2
  pour Bottom (isolate 0.178): 37.8,33.44 0.36,33.44 0.36,0.36 37.8,0.36
LED1
  Top 0.152: R17.2 32.06,25.24 31.3,26.01 31.3,27.07 30.62,27.75 U6.31
LED2
  Top 0.152: U6.33 30.52,29.15 34.22,25.45 R18.2
MOSI  (via drill 0.35)
  Top 0.152: U6.27 29.76,24.91 27.86,24.91 v27.56,24.61 | v18.97,17.12 18.2,17.89 U3.19
  Bottom 0.152: v27.56,24.61 20.07,17.12 v18.97,17.12
N$1
  Top 0.152: U3.11 12.6,21.27 R6.2
N$2
  Top 0.152: U3.26 23.1,17.76 22.02,16.68 R7.1
N$3
  Top 0.152: C13.2 6.01,22.34 5.79,22.12 5.79,20.45 5.84,20.4 5.87,20.4 6.33,19.94 6.33,19.1 U3.2
N$5
  Top 0.152: U3.3 6.7,19.37 6.7,20.26 6.48,20.49 C13.1
N$7
  Top 0.152: C15.2 U3.4
N$8
  Top 0.152: U3.5 8.69,19.37 8.69,20.26 9.01,20.58 C15.1
N$11
  Top 0.152: R10.2 6.03,7.38 U2.12
N$12
  Top 0.152: R16.2 6.84,8.94 U2.11
N$13
  Top 0.152: U3.28 24.53,19.03 C16.2
N$14
  Top 0.152: R20.2 2.84,3.81 LED3.C
N$15
  Top 0.152: C18.2 23.8,17.2 U3.27
N$16
  Top 0.152: R21.2 16.38,9.73 LED4.C
N$26  (1 unrouted)
  Top 0.152: 19.29,21.71 XTAL4.P$1 19.66,21.71 19.92,21.45 20.17,21.45 20.61,21.01 21.34,21.01 21.7,21.37 U6.13 | C28.2 18.86,21.81
N$27
  Top 0.152: U6.14 22.4,22.99 22.08,23.31 XTAL4.P$2 17.34,23.31 C29.1
N$28
  Top 0.152: R17.1 LED5.A
N$29
  Top 0.152: R18.1 LED6.A
N$30
  Top 0.508: L3.1 17.34,26.29 18.68,24.95 U6.10
N$31  (1 unrouted)
  Top 0.508: C27.1 17.33,28.53 | L3.2 18.65,27.21 18.65,26.32 19.31,25.65 U6.9
RESET  (via drill 0.35)
  Top 0.152: SW8.1 34.21,16.72 R19.1 34.36,14.83 | 34.36,14.83 D3.+ 34.44,12.82 C33.2 | CORTEX3.10 35.36,24.08 36.2,23.24 36.2,16.67 34.36,14.83 | 31.15,29.66 31.15,29.59 31.18,29.54 v31.18,29.5 30.83,29.85 30.83,30.19 30.46,30.55 U6.35
  Bottom 0.152: CORTEX3.10 35.36,26.84 34.6,26.08 33.67,26.08 31.18,28.57 v31.18,29.5
RXD.FT
  Top 0.152: U2.4 14.64,4.2 R3.1
RXD.NRF  (1 unrouted)
RXLED
  Top 0.152: U2.17 7.55,3.98 7.1,3.98 6.93,3.81 R20.1
SCK  (via drill 0.35)
  Top 0.152: U6.26 28.74,24.25 v28.01,23.53 | v17.75,16.4 17.5,16.64 U3.18
  Bottom 0.152: v28.01,23.53 20.88,16.4 v17.75,16.4
SCL  (2 unrouted)
SDA  (2 unrouted)
SWCLK
  Top 0.152: CORTEX3.4 36.38,31.99 36.38,32.77 36.03,33.11 33.45,33.11 31.59,31.25 U6.36
SWDIO  (via drill 0.35)
  Top 0.152: U6.37 31.39,31.95 v31.41,31.97
  Bottom 0.152: CORTEX3.2 35.36,32.52 34.92,32.96 32.39,32.96 v31.41,31.97
SWO  (via drill 0.35)
  Top 0.152: v32.23,26.43 32.23,26.73 30.52,28.45 U6.32
  Bottom 0.152: v32.23,26.43 32.41,26.43 33.53,25.31 36.16,25.31 36.61,25.75 36.61,29.7 CORTEX3.6
TXD.FT
  Top 0.152: R1.1 6.11,2.3 U2.20
TXD.NRF  (1 unrouted)
TXLED
  Top 0.152: U2.10 14.26,8.01 R21.1
USB+  (via drill 0.35)
  Top 0.152: R16.1 4.1,9.13 C9.1 4.1,11.43 v4.53,11.86 | v4.53,11.86
  Bottom 0.152: v4.53,11.86 4.09,12.31 4.09,12.43 3.95,12.56 2.77,12.56 2.63,12.43 2.63,11.14 2.77,11 2.79,11 3.38,10.42 3.38,7.82 3.6,7.59 5.57,7.59 5.71,7.46 5.71,6.43 5.81,6.33 5.35,5.87 USB2.3
USB-  (via drill 0.35)
  Top 0.152: R10.1 4.29,7.34 C10.2 2.91,7.15 2.02,6.27 2.02,3.39 2.54,2.87 3.26,2.87 3.48,2.65 3.48,1.58 3.67,1.39 v7.23,1.39
  Bottom 0.152: v7.23,1.39 6.77,1.85 5.83,1.85 5.43,2.25 5.43,3.91 5.22,4.12 3.7,4.12 3.55,4.27 3.55,4.86 3.69,4.99 4.41,4.99 USB2.2
V_USB  (1 unrouted)
  Bottom 0.406: USB2.1 5.75,4.56 5.97,4.78 D5.+
VIN
  Bottom 0.61: 8.94,2.11 8.92,2.09 | 9.19,2.17 9.27,2.09
  Bottom 0.711: D5.- 7.75,2.48 D4.- 8.13,2.09 8.92,2.09 9.27,2.09 12.2,2.09
VLIPO
  Top 0.152: R13.2 3.58,15.69 J2.2
  Bottom 0.61: J2.2 6.38,14.07 8.96,11.49 8.96,8.5 8.85,8.38 8.48,8.38 8.21,8.12 8.21,6.97 7.77,6.53 D4.+